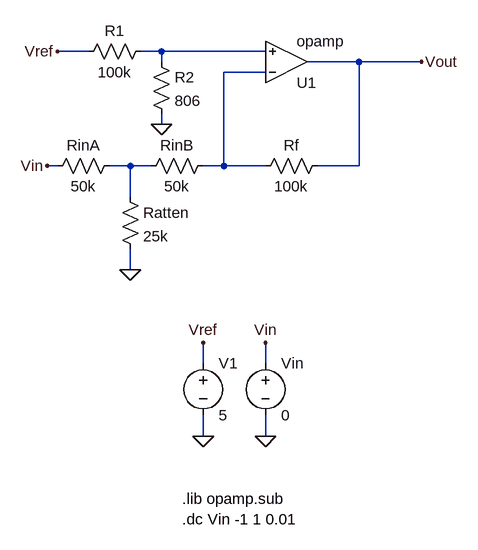
[diagram p0: schematic anbp.asc]
anbp.asc, the LTspice schematic file:
Version 4
SHEET 1 880 800
WIRE -112 64 -160 64
WIRE 0 64 -32 64
WIRE 160 64 0 64
WIRE 0 80 0 64
WIRE 304 80 224 80
WIRE 400 80 304 80
WIRE 160 96 96 96
WIRE 0 176 0 160
WIRE -160 240 -176 240
WIRE -48 240 -80 240
WIRE -16 240 -48 240
WIRE 96 240 96 96
WIRE 96 240 64 240
WIRE 160 240 96 240
WIRE 304 240 304 80
WIRE 304 240 240 240
WIRE -48 288 -48 240
WIRE -48 400 -48 368
WIRE 64 544 64 512
WIRE 160 544 160 512
WIRE 64 656 64 624
WIRE 160 656 160 624
FLAG 64 512 Vref
FLAG 64 656 0
FLAG 160 656 0
FLAG 400 80 Vout
FLAG -176 240 Vin
FLAG 160 512 Vin
FLAG -48 400 0
FLAG -160 64 Vref
FLAG 0 176 0
SYMBOL voltage 160 528 R0
SYMATTR InstName Vin
SYMATTR Value 0
SYMBOL res 256 224 R90
WINDOW 0 0 56 VBottom 2
WINDOW 3 32 56 VTop 2
SYMATTR InstName Rf
SYMATTR Value 100k
SYMBOL voltage 64 528 R0
SYMATTR InstName V1
SYMATTR Value 5
SYMBOL Opamps\\opamp 192 144 M180
SYMATTR InstName U1
SYMBOL res -64 272 R0
SYMATTR InstName Ratten
SYMATTR Value 25k
SYMBOL res -16 48 R90
WINDOW 0 0 56 VBottom 2
WINDOW 3 32 56 VTop 2
SYMATTR InstName R1
SYMATTR Value 100k
SYMBOL res -16 64 R0
SYMATTR InstName R2
SYMATTR Value 806
SYMBOL res 80 224 R90
WINDOW 0 0 56 VBottom 2
WINDOW 3 32 56 VTop 2
SYMATTR InstName RinB
SYMATTR Value 50k
SYMBOL res -64 224 R90
WINDOW 0 0 56 VBottom 2
WINDOW 3 32 56 VTop 2
SYMATTR InstName RinA
SYMATTR Value 50k
TEXT 32 784 Left 2 !.dc Vin -1 1 0.01
TEXT 32 752 Left 2 !.lib opamp.sub

The netlist it stands for:
* anbp.asc
Vin Vin 0 0
Rf Vout N002 100k
V1 Vref 0 5
XU1 N002 N001 Vout opamp Aol=100K GBW=10Meg  ; pins invin noninvin out
Ratten N003 0 25k
R1 N001 Vref 100k
R2 N001 0 806
RinB N002 N003 50k
RinA N003 Vin 50k
.dc Vin -1 1 0.01
.lib opamp.sub
.backanno
.end